# Altium schematic sheet PWR_MAIN.SchDoc
size 420 x 297 mm; Scale: 1:1; DocumentType: Схема электрическая принципиальная; SheetNumber: 5; SheetTotal: 32; DocumentTypeShort: Э3; DocumentInvertoryNumber: ㅤ
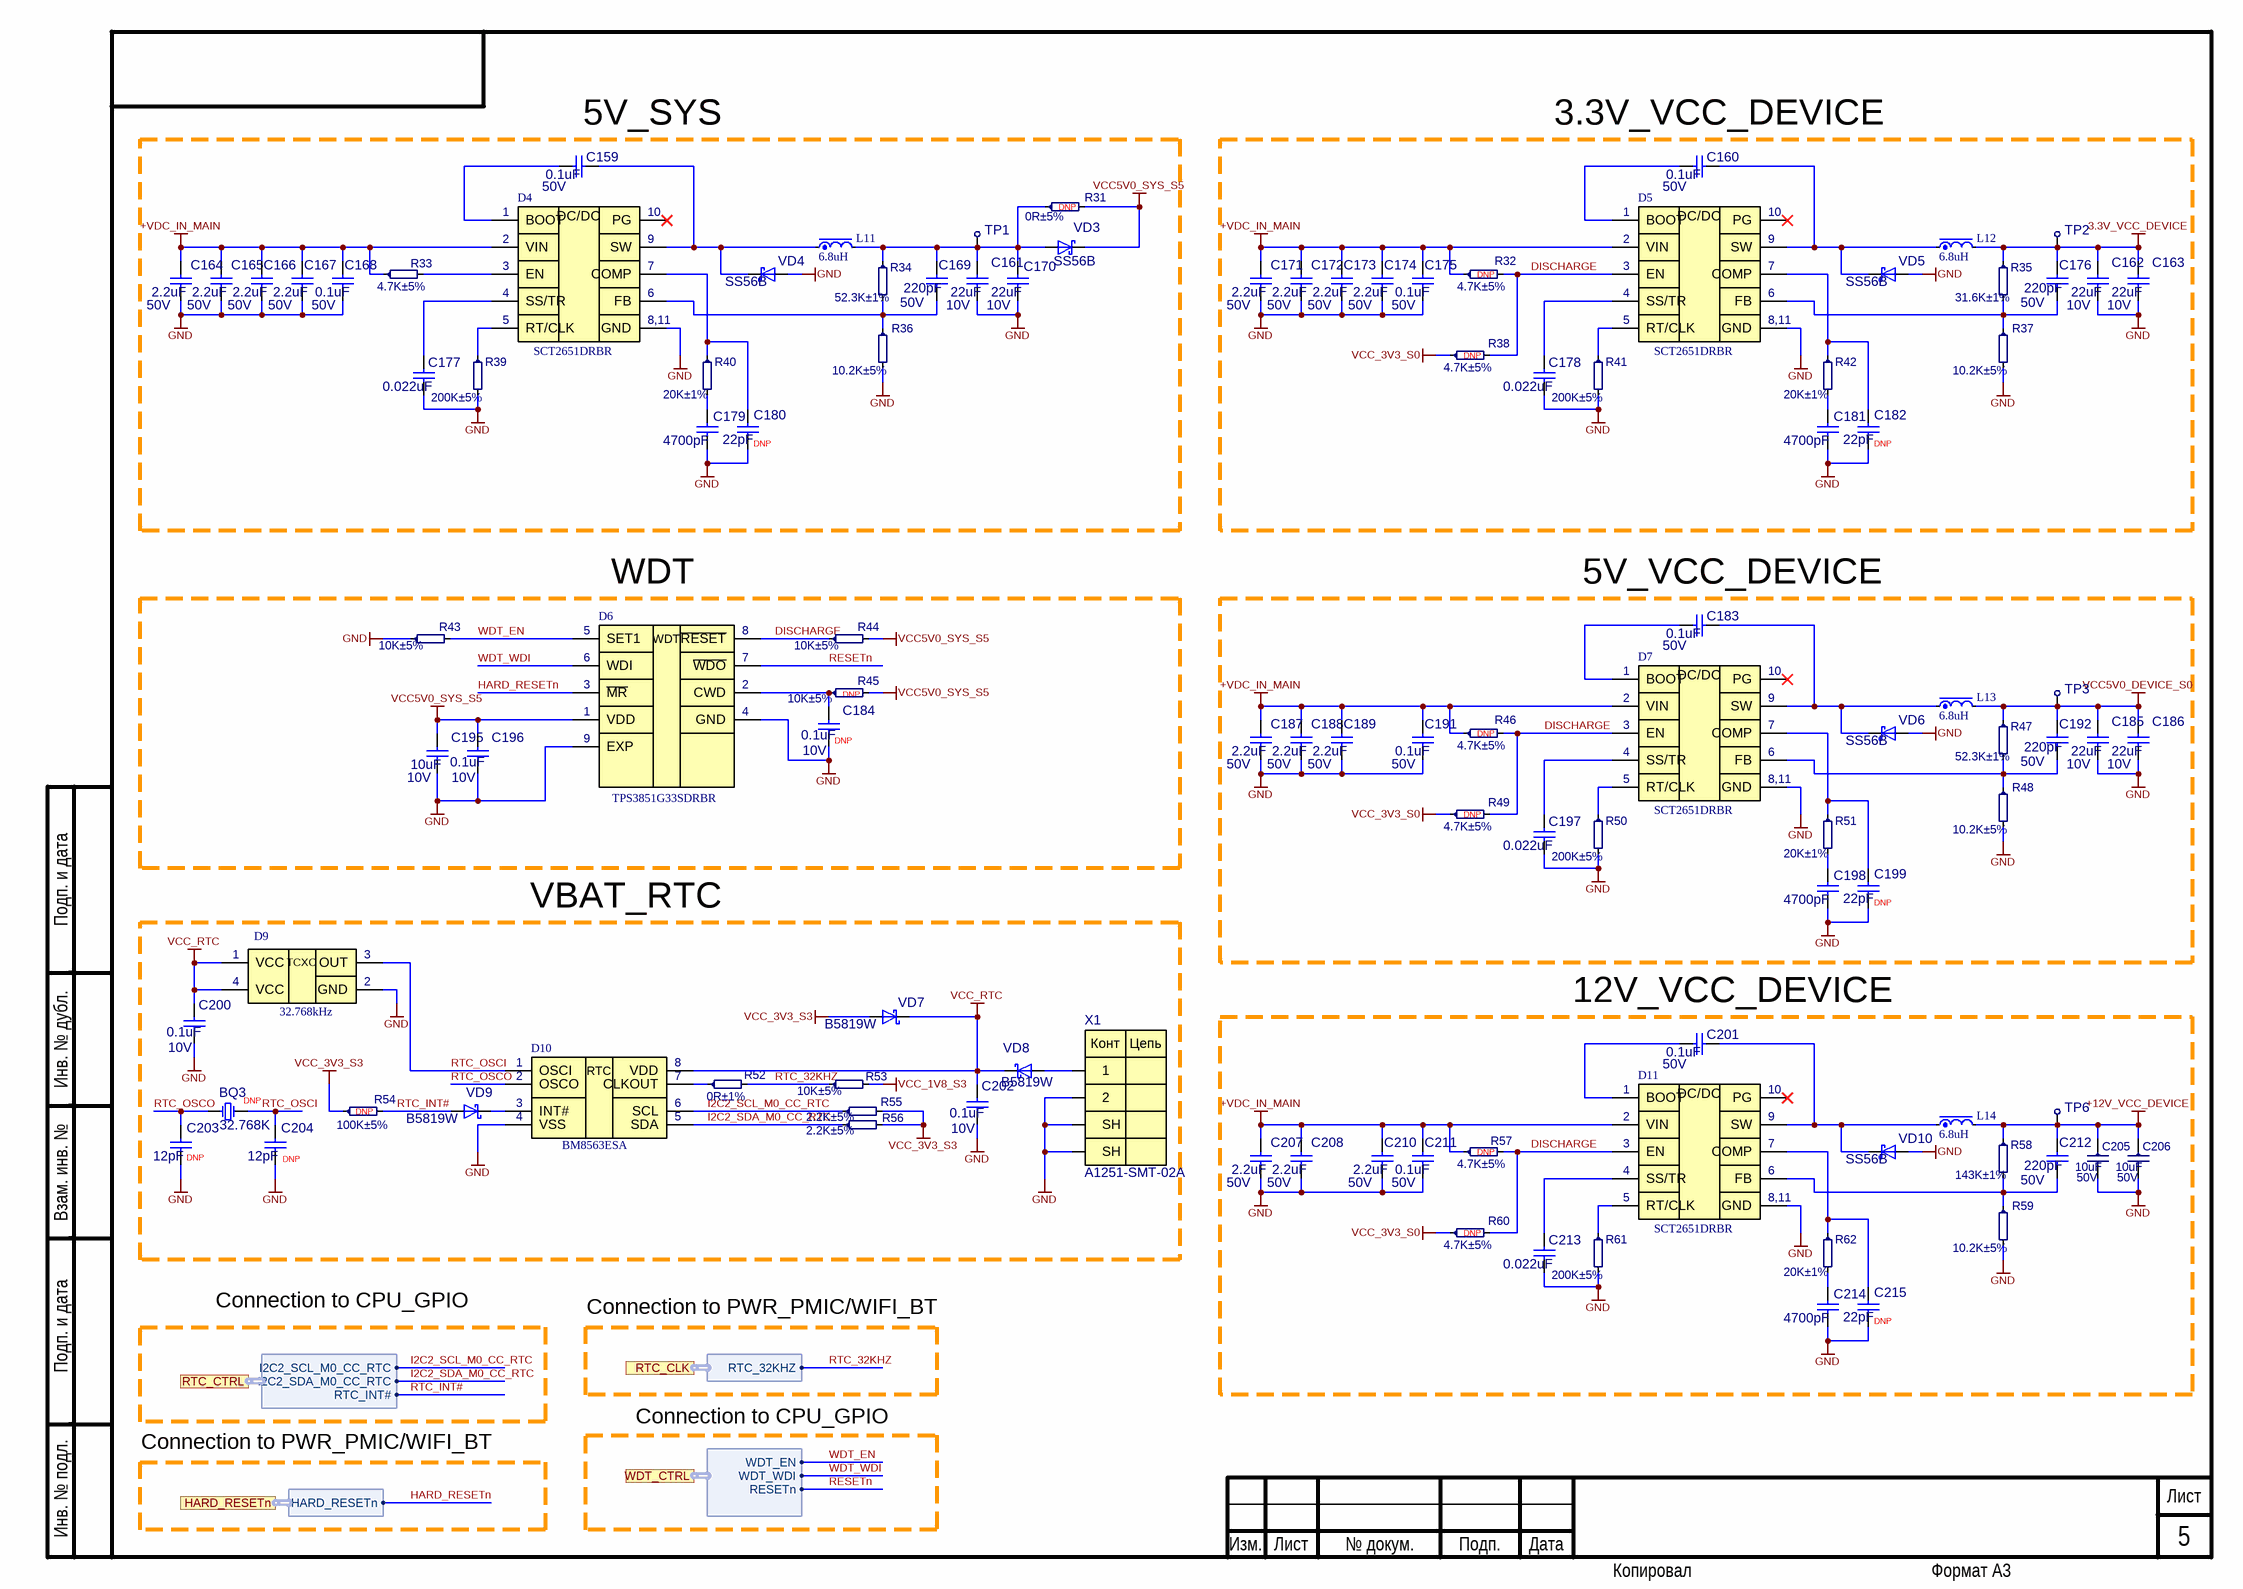
[diagram p0: PWR_MAIN.SchDoc]

## Parts
BQ3  32.768K  [NX3215SA]
C159  0.1uF  Voltage: 50V  [C0402]
C160  0.1uF  Voltage: 50V  [C0402]
C161  22uF  Voltage: 10V  [C0603]
C162  22uF  Voltage: 10V  [C0603]
C163  22uF  Voltage: 10V  [C0603]
C164  2.2uF  Voltage: 50V  [C0805]
C165  2.2uF  Voltage: 50V  [C0805]
C166  2.2uF  Voltage: 50V  [C0805]
C167  2.2uF  Voltage: 50V  [C0805]
C168  0.1uF  Voltage: 50V  [C0402]
C169  220pF  Voltage: 50V  [C0402]
C170  22uF  Voltage: 10V  [C0603]
C171  2.2uF  Voltage: 50V  [C0805]
C172  2.2uF  Voltage: 50V  [C0805]
C173  2.2uF  Voltage: 50V  [C0805]
C174  2.2uF  Voltage: 50V  [C0805]
C175  0.1uF  Voltage: 50V  [C0402]
C176  220pF  Voltage: 50V  [C0402]
C177  0.022uF  [C0402]
C178  0.022uF  [C0402]
C179  4700pF  [C0402]
C180  22pF  [C0402]
C181  4700pF  [C0402]
C182  22pF  [C0402]
C183  0.1uF  Voltage: 50V  [C0402]
C184  0.1uF  Voltage: 10V  [C0402]
C185  22uF  Voltage: 10V  [C0603]
C186  22uF  Voltage: 10V  [C0603]
C187  2.2uF  Voltage: 50V  [C0805]
C188  2.2uF  Voltage: 50V  [C0805]
C189  2.2uF  Voltage: 50V  [C0805]
C191  0.1uF  Voltage: 50V  [C0402]
C192  220pF  Voltage: 50V  [C0402]
C195  10uF  Voltage: 10V  [C0402]
C196  0.1uF  Voltage: 10V  [C0402]
C197  0.022uF  [C0402]
C198  4700pF  [C0402]
C199  22pF  [C0402]
C200  0.1uF  Voltage: 10V  [C0402]
C201  0.1uF  Voltage: 50V  [C0402]
C202  0.1uF  Voltage: 10V  [C0402]
C203  12pF  [C0402]
C204  12pF  [C0402]
C205  10uF  Voltage: 50V  [C1206]
C206  10uF  Voltage: 50V  [C1206]
C207  2.2uF  Voltage: 50V  [C0805]
C208  2.2uF  Voltage: 50V  [C0805]
C210  2.2uF  Voltage: 50V  [C0805]
C211  0.1uF  Voltage: 50V  [C0402]
C212  220pF  Voltage: 50V  [C0402]
C213  0.022uF  [C0402]
C214  4700pF  [C0402]
C215  22pF  [C0402]
D4  SCT2651DRBR  [SCT2651DRBR]
D5  SCT2651DRBR  [SCT2651DRBR]
D6  TPS3851G33SDRBR  [TPS3851G33SDRBR]
D7  SCT2651DRBR  [SCT2651DRBR]
D9  32.768kHz  [1XZA032768AD19]
D10  BM8563ESA  [BM8563ESA]
D11  SCT2651DRBR  [SCT2651DRBR]
L11  6.8uH  [MWSA0603S-6R8MT]
L12  6.8uH  [MWSA0603S-6R8MT]
L13  6.8uH  [MWSA0603S-6R8MT]
L14  6.8uH  [MWSA0603S-6R8MT]
R31  0R±5%  [R2010]
R32  4.7K±5%  [R0402]
R33  4.7K±5%  [R0402]
R34  52.3K±1%  [R0402]
R35  31.6K±1%  [R0402]
R36  10.2K±5%  [R0402]
R37  10.2K±5%  [R0402]
R38  4.7K±5%  [R0402]
R39  200K±5%  [R0402]
R40  20K±1%  [R0402]
R41  200K±5%  [R0402]
R42  20K±1%  [R0402]
R43  10K±5%  [R0402]
R44  10K±5%  [R0402]
R45  10K±5%  [R0402]
R46  4.7K±5%  [R0402]
R47  52.3K±1%  [R0402]
R48  10.2K±5%  [R0402]
R49  4.7K±5%  [R0402]
R50  200K±5%  [R0402]
R51  20K±1%  [R0402]
R52  0R±1%  [R0402]
R53  10K±5%  [R0402]
R54  100K±5%  [R0402]
R55  2.2K±5%  [R0402]
R56  2.2K±5%  [R0402]
R57  4.7K±5%  [R0402]
R58  143K±1%  [R0402]
R59  10.2K±5%  [R0402]
R60  4.7K±5%  [R0402]
R61  200K±5%  [R0402]
R62  20K±1%  [R0402]
TP1  Тестовая точка  [TEST]  (value not drawn)  (no BOM)
TP2  Тестовая точка  [TEST]  (value not drawn)  (no BOM)
TP3  Тестовая точка  [TEST]  (value not drawn)  (no BOM)
TP6  Тестовая точка  [TEST]  (value not drawn)  (no BOM)
VD3  SS56B  [DO-214AA]
VD4  SS56B  [DO-214AA]
VD5  SS56B  [DO-214AA]
VD6  SS56B  [DO-214AA]
VD7  B5819W  [B5819W]
VD8  B5819W  [B5819W]
VD9  B5819W  [B5819W]
VD10  SS56B  [DO-214AA]
X1  A1251-SMT-02A  [A1251-SMT-02A]

## Ports
HARD_RESETn (harness HARD_RESETn), RTC_CLK (harness RTC_CLK), RTC_CTRL (harness RTC_CTRL), WDT_CTRL (harness WDT_CTRL)

## Harnesses
RTC_CLK: RTC_32KHZ
RTC_CTRL: I2C2_SCL_M0_CC_RTC, I2C2_SDA_M0_CC_RTC, RTC_INT#
WDT_CTRL: WDT_WDI, WDT_EN, RESETn
HARD_RESETn: HARD_RESETn

## Nets
3.3V_VCC_DEVICE: C162.2 C163.2 C176.2 L12.2 R35.1 TP2.1
+12V_VCC_DEVICE: C205.1 C206.1 C212.2 L14.2 R58.1 TP6.1
+VDC_IN_MAIN: C164.2 C165.2 C166.2 C167.2 C168.2 C171.2 C172.2 C173.2 C174.2 C175.2 C187.2 C188.2 C189.2 C191.2 C207.2 C208.2 C210.2 C211.2 D4.2(VIN) D5.2(VIN) D7.2(VIN) D11.2(VIN) R32.1 R33.1 R46.1 R57.1
GND: C161.1 C162.1 C163.1 C164.1 C165.1 C166.1 C167.1 C168.1 C170.1 C171.1 C172.1 C173.1 C174.1 C175.1 C177.1 C178.1 C179.1 C180.1 C181.1 C182.1 C184.1 C185.1 C186.1 C187.1 C188.1 C189.1 C191.1 C195.1 C196.1 C197.1 C198.1 C199.1 C200.1 C202.1 C203.1 C204.1 C205.2 C206.2 C207.1 C208.1 C210.1 C211.1 C213.1 C214.1 C215.1 D4.8,11(GND) D5.8,11(GND) D6.4(GND) D6.9(EXP) D7.8,11(GND) D9.2(GND) D10.4(VSS) D11.8,11(GND) R36.2 R37.2 R39.2 R41.2 R43.1 R48.2 R50.2 R59.2 R61.2 VD4.2(A) VD5.2(A) VD6.2(A) VD10.2(A) X1.2 X1.3(SH) X1.4(SH)
VCC5V0_DEVICE_S0: C185.2 C186.2 C192.2 L13.2 R47.1 TP3.1
VCC5V0_SYS_S5: C195.2 C196.2 D6.1(VDD) R31.2 R44.2 R45.2 VD3.1(K)
VCC_1V8_S3: R53.2
VCC_3V3_S0: R38.1 R49.1 R60.1
VCC_3V3_S3: R54.1 R55.2 R56.2 VD7.2(A)
VCC_RTC: C200.2 C202.2 D9.1(VCC) D9.4(VCC) D10.8(VDD) VD7.1(K) VD8.1(K)
DISCHARGE: D5.3(EN) D6.8(~{RESET}) D7.3(EN) D11.3(EN) R32.2 R38.2 R44.1 R46.2 R49.2 R57.2 R60.2
HARD_RESETn: D6.3(~{MR}) ; port HARD_RESETn.HARD_RESETn
I2C2_SCL_M0_CC_RTC: D10.6(SCL) R55.1 ; port RTC_CTRL.I2C2_SCL_M0_CC_RTC
I2C2_SDA_M0_CC_RTC: D10.5(SDA) R56.1 ; port RTC_CTRL.I2C2_SDA_M0_CC_RTC
RESETn: D6.7(~{WDO}) ; port WDT_CTRL.RESETn
RTC_32KHZ: R52.2 R53.1 ; port RTC_CLK.RTC_32KHZ
RTC_INT#: R54.2 VD9.2(A) ; port RTC_CTRL.RTC_INT#
RTC_OSCI: BQ3.2(out) C204.2 D9.3(OUT) D10.1(OSCI)
RTC_OSCO: BQ3.1(inp) C203.2 D10.2(OSCO)
WDT_EN: D6.5(SET1) R43.2 ; port WDT_CTRL.WDT_EN
WDT_WDI: D6.6(WDI) ; port WDT_CTRL.WDT_WDI
NetC159_1: C159.1 D4.9(SW) L11.1 VD4.1(K)
NetC159_2: C159.2 D4.1(BOOT)
NetC160_1: C160.1 D5.9(SW) L12.1 VD5.1(K)
NetC160_2: C160.2 D5.1(BOOT)
NetC161_2: C161.2 C169.2 C170.2 L11.2 R31.1 R34.1 TP1.1 VD3.2(A)
NetC169_1: C169.1 D4.6(FB) R34.2 R36.1
NetC176_1: C176.1 D5.6(FB) R35.2 R37.1
NetC177_2: C177.2 D4.4(SS/TR)
NetC178_2: C178.2 D5.4(SS/TR)
NetC179_2: C179.2 R40.2
NetC180_2: C180.2 D4.7(COMP) R40.1
NetC181_2: C181.2 R42.2
NetC182_2: C182.2 D5.7(COMP) R42.1
NetC183_1: C183.1 D7.9(SW) L13.1 VD6.1(K)
NetC183_2: C183.2 D7.1(BOOT)
NetC184_2: C184.2 D6.2(CWD) R45.1
NetC192_1: C192.1 D7.6(FB) R47.2 R48.1
NetC197_2: C197.2 D7.4(SS/TR)
NetC198_2: C198.2 R51.2
NetC199_2: C199.2 D7.7(COMP) R51.1
NetC201_1: C201.1 D11.9(SW) L14.1 VD10.1(K)
NetC201_2: C201.2 D11.1(BOOT)
NetC212_1: C212.1 D11.6(FB) R58.2 R59.1
NetC213_2: C213.2 D11.4(SS/TR)
NetC214_2: C214.2 R62.2
NetC215_2: C215.2 D11.7(COMP) R62.1
NetD4_3: D4.3(EN) R33.2
NetD4_5: D4.5(RT/CLK) R39.1
NetD5_5: D5.5(RT/CLK) R41.1
NetD7_5: D7.5(RT/CLK) R50.1
NetD10_3: D10.3(INT#) VD9.1(K)
NetD10_7: D10.7(CLKOUT) R52.1
NetD11_5: D11.5(RT/CLK) R61.1
NetVD8_2: VD8.2(A) X1.1

Not connected (* = marked no-connect by the designer): D4 10(PG)*; D5 10(PG)*; D7 10(PG)*; D11 10(PG)*

## Notes on the sheet
- (near C159) 5V_SYS
- (near C160) 3.3V_VCC_DEVICE
- (near R31) DNP
- (near R32) DNP
- (near R38) DNP
- (near C180) DNP
- (near C182) DNP
- (near D6) WDT
- (near C183) 5V_VCC_DEVICE
- (near R45) DNP
- (near R46) DNP
- (near C184) DNP
- (near R49) DNP
- VBAT_RTC
- (near C199) DNP
- (near C201) 12V_VCC_DEVICE
- (near BQ3) DNP
- (near R54) DNP
- (near C203) DNP
- (near C204) DNP
- (near R57) DNP
- (near R60) DNP
- Connection to CPU_GPIO
- Connection to PWR_PMIC/WIFI_BT
- (near C215) DNP
- Подп. и дата
- Инв. № дубл.
- Взам. инв. №
- Инв. № подл.
- Изм.
- Лист
- № докум.
- Подп.
- Дата
- Копировал
- Формат А3
- (in symbol 1XZA032768AD19) TCXO
- (in symbol A1251-SMT-02A) Конт; Цепь
- (in symbol BM8563ESA) RTC
- (in symbol SCT2651DRBR) DC/DC
- (in symbol TPS3851G33SDRBR) WDT

## Library data of the parts
BQ3 = SJK-7L-32.768-12.5-20-70-C: *; Manufacturer: SJK; Place: S; Tolerance: 3ppm; Check: False; Part Number: SJK-7L-32.768-12.5-20-70-C; Value: 32.768K; Temperature: -40°C~85°C; NameFromManufacturer: SJK-7L-32.768-12.5-20-70-C; ComponentLink1Description: DATASHEET; ComponentLink1URL: https://roboparts.ru/upload/iblock/095/095a21a3f536a48ddbbe95c19b949316.pdf; Datasheet: Datasheets/quartz/095a21a3f536a48ddbbe95c19b949316.pdf; Last changed: 27.10.2022
C159 C160 C168 C175 C183 C191 C201 C211 = 0402-X5R-50V-0.1uF±10%: Manufacturer: Yageo; NameFromManufacturer: CC0402KRX5R9BB104; Place: S; Tolerance: 10%; Check: False; Part Number: 0402-X5R-50V-0.1uF±10%; Value: 0.1uF; Temperature: -55°C~85°C; ComponentLink2Description: Link to datasheet; ComponentLink1Description: DATASHEET; ComponentLink2URL: https://www.yageo.com/upload/media/product/productsearch/datasheet/mlcc/UPY-GPHC_X5R_4V-to-50V_26.pdf; ComponentLink1URL: Datasheets/capacitors/UPY-GPHC_X5R_4V-to-50V_26.pdf; Last changed: 27.10.2022
C161-C163 C170 C185 C186 = 0603-X5R-10V-22uF±20%: *; Manufacturer: Murata; NameFromManufacturer: GRM188R61A226ME15D; Place: S; Tolerance: 20%; Part Number: 0603-X5R-10V-22uF±20%; Value: 22uF; Temperature: -55°C~85°C; ComponentLink2Description: Link to datasheet; ComponentLink1Description: DATASHEET
C164-C167 C171-C174 C187-C189 C207 C208 C210 = 0805-X7R-50V-2.2uF±10%: Manufacturer: Yageo; NameFromManufacturer: CC0805KKX7R9BB225; Place: S; Tolerance: 10%; Check: False; Part Number: 0805-X7R-50V-2.2uF±10%; Value: 2.2uF; Temperature: -55°C~125°C; ComponentLink2Description: Link to datasheet; ComponentLink1Description: DATASHEET; ComponentLink2URL: https://www.yageo.com/upload/media/product/productsearch/datasheet/mlcc/UPY-GPHC_X7R_6.3V-to-50V_18.pdf; ComponentLink1URL: Datasheets/capacitors/UPY-GPHC_X7R_6.3V-to-50V_18.pdf; Last changed: 27.10.2022
C169 C176 C192 C212 = 0402-NP0-50V-220pF±5%: *; Manufacturer: Yageo; NameFromManufacturer: CC0402JRNPO9BN221; Place: S; Tolerance: 5%; Check: False; Part Number: 0402-NP0-50V-220pF±5%; Value: 220pF; Temperature: -55°C~125°C; ComponentLink2Description: Link to datasheet; ComponentLink1Description: DATASHEET; ComponentLink2URL: https://octopart.com/cc0402jrnpo9bn221-yageo-42335946?r=sp#Specs; ComponentLink1URL: Datasheets/capacitors/MV.pdf; Last changed: 27.10.2022
C177 C178 C197 C213 = 0402-X7R-50V-0.022uF±10%: Manufacturer: Murata Electronics; NameFromManufacturer: GRM155R71H223KA12D; Place: S; Voltage: 50V; Tolerance: 10%; Check: False; Part Number: 0402-X7R-50V-0.022uF±10%; Value: 0.022uF; Temperature: -55°C~125°C; ComponentLink2Description: Link to datasheet; ComponentLink1Description: DATASHEET; ComponentLink2URL: https://www.terraelectronica.ru/product/866781; ComponentLink1URL: Datasheets/capacitors/GRM155R71H223KA12#.pdf; Last changed: 27.10.2022
C179 C181 C198 C214 = 0402-X7R-50V-4700pF±10%: *; Manufacturer: Yageo; NameFromManufacturer: CC0402KRX7R9BB472; Place: S; Voltage: 50V; Tolerance: 10%; Check: False; Part Number: 0402-X7R-50V-4700pF±10%; Value: 4700pF; Temperature: -55°C~125°C; ComponentLink2Description: Link to datasheet; ComponentLink1Description: DATASHEET; ComponentLink2URL: https://octopart.com/cc0402krx7r9bb472-yageo-9288149?r=sp; ComponentLink1URL: Datasheets/capacitors/UPY-GPHC_X7R_6.3V-to-50V_20.pdf; Last changed: 27.10.2022
C180 C182 C199 C215 = 0402-NP0-50V-22pF ±10%: Manufacturer: Samsung; NameFromManufacturer: CL05C220JB51PNC; Place: S; Voltage: 50V; Tolerance: 10%; Check: False; Part Number: 0402-NP0-50V-22pF ±10%; Value: 22pF; Temperature: -55°C~125°C; ComponentLink2Description: Link to datasheet; ComponentLink1Description: DATASHEET; ComponentLink2URL: https://ru.mouser.com/datasheet/2/585/MLCC-1837944.pdf; ComponentLink1URL: Datasheets/capacitors/CL05C220JB51PNC_Spec.pdf; Last changed: 27.10.2022
C184 C196 C200 C202 = 0402-X7R-16V-0.1uF±10%: Part Number: 0402-X5R-10V-0.1uF±10%; Manufacturer: Yageo; NameFromManufacturer: CC0402KRX5R6BB104; Place: S; Tolerance: 10%; Check: False; Value: 0.1uF; Temperature: -55°C~125°C; ComponentLink2Description: Link to datasheet; ComponentLink1Description: DATASHEET; Last changed: 27.10.2022
C195 = 0402-X5R-10V-10uF±20: *; Manufacturer: Samsung; NameFromManufacturer: CL05A106MP5NUNC; Place: S; Tolerance: 20%; Check: False; Part Number: 0402-X5R-10V-10uF±20; Value: 10uF; Temperature: -55°C~85°C; ComponentLink2Description: Link to datasheet; ComponentLink1Description: DATASHEET; Last changed: 06.04.2023
C203 C204 = 0402-NP0-50V-12pF±5%: Manufacturer: Murata Electronics; NameFromManufacturer: GRM1555C1H120JA01D; Place: S; Voltage: 50V; Tolerance: 5%; Check: False; Part Number: 0402-NP0-50V-12pF±5%; Value: 12pF; Temperature: -55°C~125°C; ComponentLink2Description: Link to datasheet; ComponentLink1Description: DATASHEET; ComponentLink2URL: https://www.terraelectronica.ru/pdf/show?pdf_file=http%253A%252F%252Fwww.farnell.com%252Fdatasheets%252F2048662.pdf; ComponentLink1URL: Datasheets/capacitors/GRM1555C1H120JA01-01A.pdf; Last changed: 27.10.2022
C205 C206 = 1206-X5R-50V-010uF±10%: Manufacturer: Yageo; NameFromManufacturer: CC1206KKX5R9BB106; Dielectric: X5R; Place: *); Tolerance: 10%; Check: False; Case: C1206; Part Number: 1206-X5R-50V-010uF±10%; Value: 10uF; Temperature: -55°C~85°C; ComponentLink2Description: Link to datasheet; ComponentLink1Description: DATASHEET; ComponentLink2URL: https://www.terraelectronica.ru/product/2097656; ComponentLink1URL: Datasheets/capacitors/UPY-GPHC_X5R_4V-to-50V_27.pdf; Last changed: 27.10.2022
D4 D5 D7 D11 = SCT2651DRBR: 4.5V-60V Vin,5A, High Efficiency Step-down DCDC Converter with Programmable Frequency; Manufacturer: SCT; Check: False; Part Number: SCT2651DRBR; NameFromManufacturer: SCT2651DRBR; Value: SCT2651DRBR
D6 = TPS3851G33SDRBR: High-accuracy voltage supervisor with Integrated watchdog timer; Manufacturer: Texas Instruments; Check: False; Part Number: TPS3851G33SDRBR; NameFromManufacturer: TPS3851G33SDRBR; Value: TPS3851G33SDRBR
D9 = 1XZA032768AD19: Manufacturer: KDS; Check: False; Part Number: 1XZA032768AD19; NameFromManufacturer: 1XZA032768AD19; Value: 32.768kHz
D10 = BM8563ESA: I2C SOP-8 Real-time Clocks; Manufacturer: GATEMODE; Check: False; Analog: TCS8563 (SOP-8); Part Number: BM8563ESA; NameFromManufacturer: BM8563ESA; Value: BM8563ESA; ComponentLink1Description: DATASHEET; Last changed: 24.03.2023
L11-L14 = MWSA0603S-6R8MT: Fixed Ind 6.8UH 5A; Manufacturer: Sunlord; Check: False; Part Number: MWSA0603S-6R8MT; Value: 6.8uH; NameFromManufacturer: MWSA0603S-6R8MT; Current: 5A
R31 = 2010-0.75W-0R-200ppm±5%: Chip Resistor 2010 0Ω ±5% 200V ±200ppm/℃ Thick Film; NameFromManufacturer: RC2010JK-070RL; Manufacturer: Yageo; Place: *); Value: 0R; Check: False; Case: R2010; Part Number: 2010-0.75W-0R-200ppm±5%; Tolerance: 5%; Temperature: -55°C~155°C; ComponentLink1Description: DATASHEET; ComponentLink1URL: https://www.lcsc.com/product-detail/Chip-Resistor-Surface-Mount_YAGEO-RC2010JK-070RL_C152156.html; Last changed: 16.07.2024
R32 R33 R38 R46 R49 R57 R60 = 0402-0.0625W-4.7K-100ppm±5%: NameFromManufacturer: RC0402JR-074K7L; Manufacturer: Yageo; Place: *); Value: 4.7K; Tolerance: 5%; Check: False; Case: R0402; Part Number: 0402-0.0625W-4.7K-100ppm±5%; Temperature: -55°C~155°C; ComponentLink1Description: DATASHEET; ComponentLink1URL: https://ru.mouser.com/ProductDetail/YAGEO/RC0402JR-074K7L?qs=%2Fha2pyFadugNN0LzwXn2qDR0lAGI9qruexMTkPBFwcD9DqmvUvet2g%3D%3D; Datasheet: Datasheets/resistors/PYu-RC_Group_51_RoHS_L_11.pdf; Last changed: 27.10.2022
R34 R47 = 0402-0.0625W-52.3K-100ppm±1%: NameFromManufacturer: RC0402FR-0752K3L; Manufacturer: Yageo; Place: *); Value: 52.3K; Tolerance: 1%; Check: False; Case: R0402; Part Number: 0402-0.0625W-52.3K-100ppm±1%; Temperature: -55°C~155°C; ComponentLink1Description: DATASHEET; ComponentLink1URL: https://www.promelec.ru/product/306095/; Datasheet: Datasheets/resistors/PYu-RC_Group_51_RoHS_L_12.pdf; Last changed: 31.03.2023
R35 = 0402-0.0625W-52.3K-100ppm±1%: Part Number: 0402-0.0625W-31.6K-100ppm±1%; NameFromManufacturer: RC0402FR-0731K6L; Manufacturer: Yageo; Place: *); Value: 31.6K; Tolerance: 1%; Check: False; Case: R0402; Temperature: -55°C~155°C; ComponentLink1Description: DATASHEET; ComponentLink1URL: https://www.promelec.ru/product/306095/; Datasheet: Datasheets/resistors/PYu-RC_Group_51_RoHS_L_12.pdf; Last changed: 31.03.2023
R36 R37 R48 R59 = 0402-0.0625W-10K-100ppm±5%: Part Number: 0402-0.0625W-10.2K-100ppm±5%; NameFromManufacturer: RC0402FR-0710K2L; Manufacturer: Yageo; Place: *); Value: 10.2K; Tolerance: 5%; Check: False; Case: R0402; Temperature: -55°C~155°C; ComponentLink1Description: DATASHEET; ComponentLink1URL: https://ru.mouser.com/ProductDetail/YAGEO/RC0402JR-0710KL?qs=%2Fha2pyFadugNN0LzwXn2qF8HRAp201xOpXu%252BapQnyvRGE%2F%252Bpr1TWjQ%3D%3D; Datasheet: Datasheets/resistors/PYu-RC_Group_51_RoHS_L_11.pdf; Last changed: 27.10.2022
R39 R41 R50 R61 = 0402-0.0625W-200K-100ppm±5%: *; NameFromManufacturer: RC0402JR-07200KL; Manufacturer: Yageo; Place: *); Value: 200K; Tolerance: 5%; Check: False; Case: R0402; Part Number: 0402-0.0625W-200K-100ppm±5%; Temperature: -55°C~125°C; ComponentLink1Description: DATASHEET; ComponentLink1URL: https://ru.mouser.com/datasheet/2/447/PYu_RC_Group_51_RoHS_L_10-1664068.pdf; Datasheet: Datasheets/resistors/PYu_RC_Group_51_RoHS_L_10-1664068.pdf; Last changed: 27.10.2022
R40 R42 R51 R62 = 0402-0.0625W-20K-100ppm±1%: Chip Resistor 0402 20kΩ ±1% 50V ±100ppm/℃ Thick Film; NameFromManufacturer: RC0402FR-0720KL; Manufacturer: Yageo; Place: *); Value: 20K; Check: False; Case: R0402; Part Number: 0402-0.0625W-20K-100ppm±1%; Tolerance: 1%; Temperature: -55°C~155°C; ComponentLink1Description: DATASHEET; ComponentLink1URL: https://www.terraelectronica.ru/product/506449; Datasheet: Datasheets/resistors/PYu-RC_Group_51_RoHS_L_11.pdf; Last changed: 27.10.2022
R43-R45 R53 = 0402-0.0625W-10K-100ppm±5%: NameFromManufacturer: RC0402JR-0710KL; Manufacturer: Yageo; Place: *); Value: 10K; Tolerance: 5%; Check: False; Case: R0402; Part Number: 0402-0.0625W-10K-100ppm±5%; Temperature: -55°C~155°C; ComponentLink1Description: DATASHEET; ComponentLink1URL: https://ru.mouser.com/ProductDetail/YAGEO/RC0402JR-0710KL?qs=%2Fha2pyFadugNN0LzwXn2qF8HRAp201xOpXu%252BapQnyvRGE%2F%252Bpr1TWjQ%3D%3D; Datasheet: Datasheets/resistors/PYu-RC_Group_51_RoHS_L_11.pdf; Last changed: 27.10.2022
R52 = 0402-0.0625W-0R-100ppm±1%: Chip Resistor 0402 0Ω ±1% 50V ±100ppm/℃ Thick Film; NameFromManufacturer: RC0402FR-070RL; Manufacturer: Yageo; Place: *); Value: 0R; Check: False; Case: R0402; Part Number: 0402-0.0625W-0R-100ppm±1%; Tolerance: 1%; Temperature: -55°C~155°C; ComponentLink1Description: DATASHEET; ComponentLink1URL: https://www.chipdip.ru/product0/8000617426?ysclid=l7og5x0plo427794326; Datasheet: Datasheets/resistors/DOC012445956.pdf; Last changed: 27.10.2022
R54 = 0402-0.0625W-100K-100ppm±5%: NameFromManufacturer: RC0402JR-07100KL; Manufacturer: Yageo; Place: *); Value: 100K; Tolerance: 5%; Check: False; Case: R0402; Part Number: 0402-0.0625W-100K-100ppm±5%; Temperature: -55°C~155°C; ComponentLink1Description: DATASHEET; ComponentLink1URL: https://ru.mouser.com/ProductDetail/YAGEO/RC0402JR-07100KL?qs=%2Fha2pyFadugNN0LzwXn2qCsICuw6vgLBeLL%252BmXUKy2OLGS9kgqrNBA%3D%3D; Datasheet: Datasheets/resistors/PYu-RC_Group_51_RoHS_L_11.pdf; Last changed: 27.10.2022
R55 R56 = 0402-0.0625W-2.2K-100ppm±5%: *; NameFromManufacturer: RC0402JR-072K2L; Manufacturer: Yageo; Place: *); Value: 2.2K; Tolerance: 5%; Check: False; Case: R0402; Part Number: 0402-0.0625W-2.2K-100ppm±5%; Temperature: -55°C~155°C; ComponentLink1Description: DATASHEET; ComponentLink1URL: https://octopart.com/ac0402jr-072k2l-yageo-23514430?r=sp; Datasheet: Datasheets/resistors/PYu-AC_51_RoHS_L_8.pdf; Last changed: 27.10.2022
R58 = 0402-0.0625W-52.3K-100ppm±1%: Part Number: 0402-0.0625W-143K-100ppm±1%; NameFromManufacturer: RC0402FR-07143KL; Manufacturer: Yageo; Place: *); Value: 143K; Tolerance: 1%; Check: False; Case: R0402; Temperature: -55°C~155°C; ComponentLink1Description: DATASHEET; ComponentLink1URL: https://www.promelec.ru/product/306095/; Datasheet: Datasheets/resistors/PYu-RC_Group_51_RoHS_L_12.pdf; Last changed: 31.03.2023
TP1-TP3 TP6 = Тестовая точка: *; Check: False; Part Number: Тестовая точка; Value: Тестовая точка; ComponentLink1Description: DATASHEET; Manufacturer: *
VD3-VD6 VD10 = B360BQ-13-F: Schottky Rectifier; Manufacturer: Yangjie (YJ); Place: S; Check: False; Part Number: SS56B; Value: SS56B; Temperature: -55°C~150°C; NameFromManufacturer: SS56B; Last changed: 27.10.2022
VD7-VD9 = B5819W: Manufacturer: MDD; Check: False; Part Number: B5819W; Value: B5819W; NameFromManufacturer: B5819W
X1 = A1251-SMT-02A: PicoBlade 1.25mm; Manufacturer: MOLEX; Check: False; Part Number: A1251-SMT-02A; Value: A1251-SMT-02A; NameFromManufacturer: A1251-SMT-02A